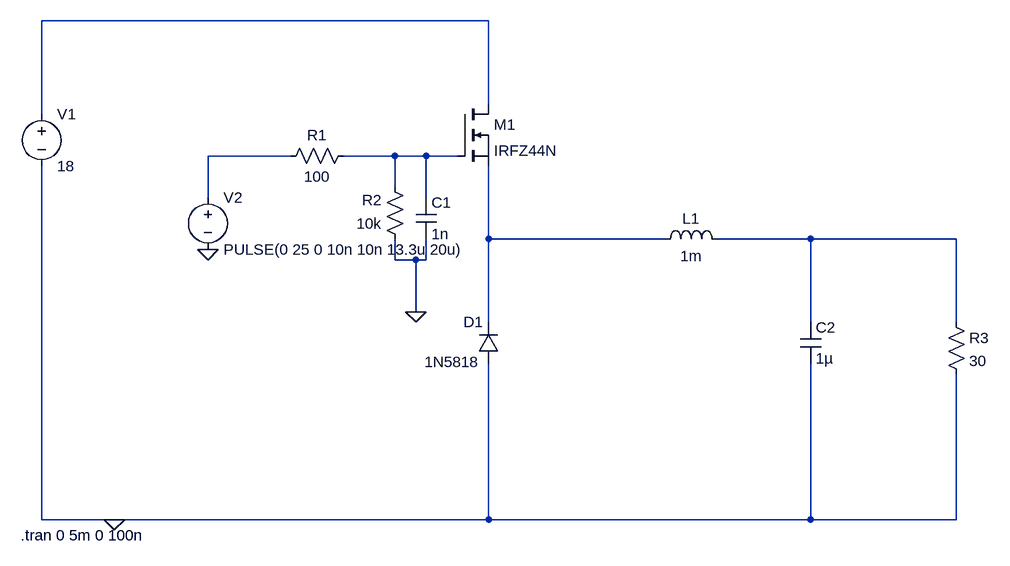
[diagram p0: schematic LED driver.asc]
LED driver.asc, the LTspice schematic file:
Version 4.1
SHEET 1 2164 760
WIRE 656 -48 -32 -48
WIRE 656 80 656 -48
WIRE -32 96 -32 -48
WIRE 352 160 224 160
WIRE 512 160 432 160
WIRE 560 160 512 160
WIRE 608 160 560 160
WIRE 512 208 512 160
WIRE 224 224 224 160
WIRE 560 224 560 160
WIRE 656 288 656 176
WIRE 928 288 656 288
WIRE 1152 288 1008 288
WIRE 1376 288 1152 288
WIRE 512 320 512 288
WIRE 544 320 512 320
WIRE 560 320 560 288
WIRE 560 320 544 320
WIRE 544 400 544 320
WIRE 656 416 656 288
WIRE 1152 416 1152 288
WIRE 1376 416 1376 288
WIRE -32 720 -32 176
WIRE 80 720 -32 720
WIRE 656 720 656 480
WIRE 656 720 80 720
WIRE 1152 720 1152 480
WIRE 1152 720 656 720
WIRE 1376 720 1376 496
WIRE 1376 720 1152 720
FLAG 544 400 0
FLAG 224 304 0
FLAG 80 720 0
SYMBOL voltage -32 80 R0
SYMATTR InstName V1
SYMATTR Value 18
SYMBOL voltage 224 208 R0
WINDOW 123 0 0 Left 0
WINDOW 39 0 0 Left 0
SYMATTR InstName V2
SYMATTR Value PULSE(0 25 0 10n 10n 13.3u 20u)
SYMBOL diode 672 480 R180
WINDOW 0 24 64 Left 2
WINDOW 3 30 3 Left 2
SYMATTR InstName D1
SYMATTR Value 1N5818
SYMBOL res 448 144 R90
WINDOW 0 0 56 VBottom 2
WINDOW 3 32 56 VTop 2
SYMATTR InstName R1
SYMATTR Value 100
SYMBOL res 528 304 R180
WINDOW 0 36 76 Left 2
WINDOW 3 36 40 Left 2
SYMATTR InstName R2
SYMATTR Value 10k
SYMBOL cap 544 224 R0
SYMATTR InstName C1
SYMATTR Value 1n
SYMBOL ind 912 304 R270
WINDOW 0 32 56 VTop 2
WINDOW 3 5 56 VBottom 2
SYMATTR InstName L1
SYMATTR Value 1m
SYMBOL cap 1136 416 R0
SYMATTR InstName C2
SYMATTR Value 1µ
SYMBOL res 1360 400 R0
SYMATTR InstName R3
SYMATTR Value 30
SYMBOL nmos 608 80 R0
SYMATTR InstName M1
SYMATTR Value IRFZ44N
TEXT -64 744 Left 2 !.tran 0 5m 0 100n

The netlist it stands for:
* LED driver.asc
V1 N001 0 18
V2 N002 0 PULSE(0 25 0 10n 10n 13.3u 20u)
D1 0 N004 1N5818
R1 N003 N002 100
R2 0 N003 10k
C1 N003 0 1n
L1 N004 N005 1m
C2 N005 0 1µ
R3 N005 0 30
M1 N001 N003 N004 N004 IRFZ44N
.model D D
.lib standard.dio
.model NMOS NMOS
.model PMOS PMOS
.lib standard.mos
.tran 0 5m 0 100n
.backanno
.end